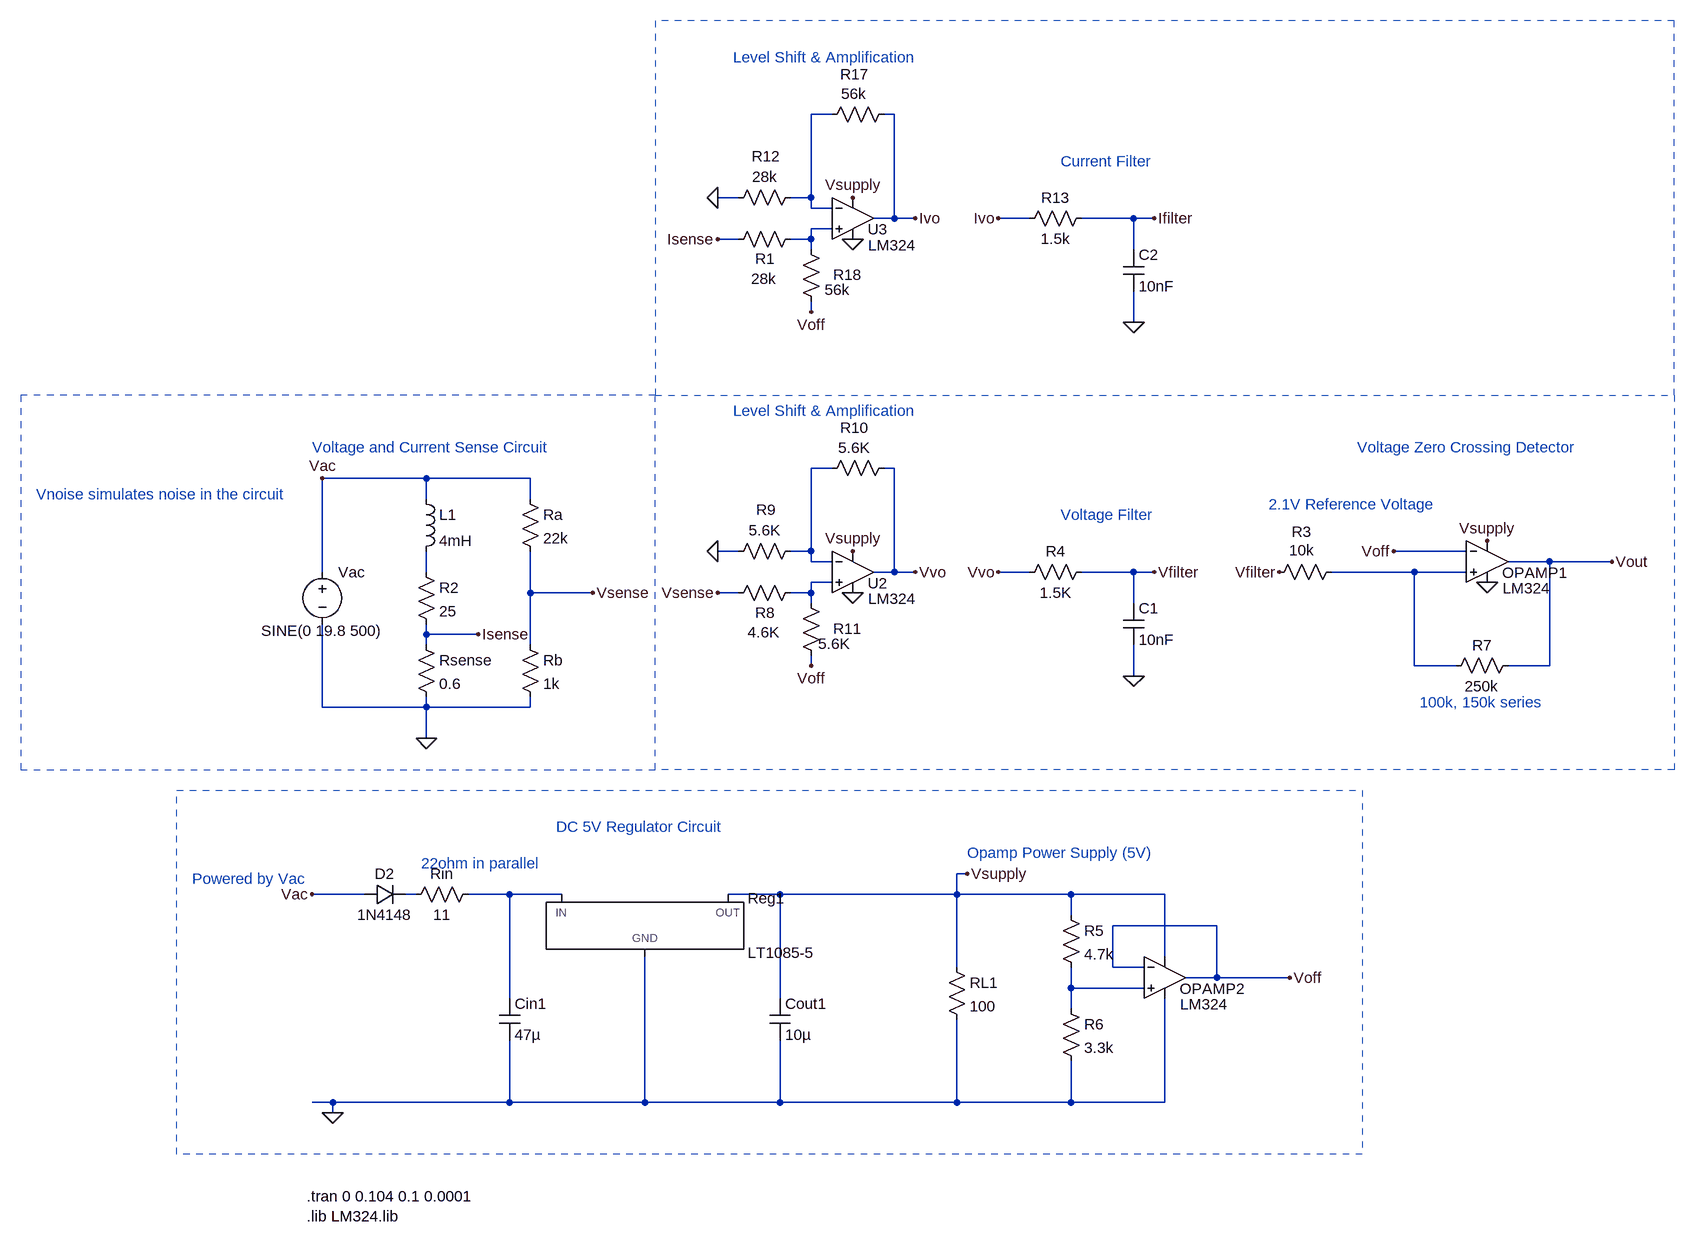
[diagram p0: schematic LTSpice implementation(With current sensor) - Copy.asc]
LTSpice implementation(With current sensor) - Copy.asc, the LTspice schematic file:
Version 4
SHEET 1 2040 1260
WIRE 64 -448 32 -448
WIRE 160 -448 144 -448
WIRE -80 -320 -112 -320
WIRE 32 -320 32 -448
WIRE 32 -320 0 -320
WIRE 32 -304 32 -320
WIRE 64 -304 32 -304
WIRE 160 -288 160 -448
WIRE 160 -288 128 -288
WIRE 192 -288 160 -288
WIRE 368 -288 320 -288
WIRE 528 -288 448 -288
WIRE 560 -288 528 -288
WIRE 64 -272 32 -272
WIRE -80 -256 -112 -256
WIRE 32 -256 32 -272
WIRE 32 -256 0 -256
WIRE 32 -240 32 -256
WIRE 528 -240 528 -288
WIRE 32 -144 32 -160
WIRE 528 -128 528 -176
WIRE 64 96 32 96
WIRE 160 96 144 96
WIRE -560 112 -720 112
WIRE -400 112 -560 112
WIRE -560 144 -560 112
WIRE -400 144 -400 112
WIRE -80 224 -112 224
WIRE 32 224 32 96
WIRE 32 224 0 224
WIRE 1040 224 928 224
WIRE 32 240 32 224
WIRE 64 240 32 240
WIRE 1168 240 1104 240
WIRE 1264 240 1168 240
WIRE -720 256 -720 112
WIRE -560 256 -560 224
WIRE 160 256 160 96
WIRE 160 256 128 256
WIRE 192 256 160 256
WIRE 368 256 320 256
WIRE 528 256 448 256
WIRE 560 256 528 256
WIRE 960 256 832 256
WIRE 1040 256 960 256
WIRE 64 272 32 272
WIRE -400 288 -400 224
WIRE -304 288 -400 288
WIRE -80 288 -112 288
WIRE 32 288 32 272
WIRE 32 288 0 288
WIRE 32 304 32 288
WIRE 528 304 528 256
WIRE -560 352 -560 336
WIRE -480 352 -560 352
WIRE -560 368 -560 352
WIRE -400 368 -400 288
WIRE 32 400 32 384
WIRE 960 400 960 256
WIRE 1024 400 960 400
WIRE 1168 400 1168 240
WIRE 1168 400 1104 400
WIRE 528 416 528 368
WIRE -720 464 -720 336
WIRE -560 464 -560 448
WIRE -560 464 -720 464
WIRE -400 464 -400 448
WIRE -400 464 -560 464
WIRE -560 512 -560 464
WIRE 272 720 256 720
WIRE -656 752 -736 752
WIRE -576 752 -592 752
WIRE -432 752 -496 752
WIRE -352 752 -432 752
WIRE -16 752 -96 752
WIRE 256 752 256 720
WIRE 256 752 -16 752
WIRE 432 752 256 752
WIRE 576 752 432 752
WIRE 432 784 432 752
WIRE 656 800 496 800
WIRE 576 848 576 752
WIRE 256 864 256 752
WIRE 496 864 496 800
WIRE 544 864 496 864
WIRE 656 880 656 800
WIRE 656 880 608 880
WIRE 768 880 656 880
WIRE 432 896 432 864
WIRE 544 896 432 896
WIRE -432 912 -432 752
WIRE -16 912 -16 752
WIRE 432 928 432 896
WIRE -704 1072 -736 1072
WIRE -432 1072 -432 976
WIRE -432 1072 -704 1072
WIRE -224 1072 -224 848
WIRE -224 1072 -432 1072
WIRE -16 1072 -16 976
WIRE -16 1072 -224 1072
WIRE 256 1072 256 944
WIRE 256 1072 -16 1072
WIRE 432 1072 432 1008
WIRE 432 1072 256 1072
WIRE 576 1072 576 912
WIRE 576 1072 432 1072
WIRE -704 1088 -704 1072
FLAG -560 512 0
FLAG 528 416 0
FLAG -720 112 Vac
FLAG -704 1088 0
FLAG -736 752 Vac
FLAG 272 720 Vsupply
FLAG 96 288 0
FLAG 96 224 Vsupply
FLAG -112 288 Vsense
FLAG -112 224 0
FLAG 192 256 Vvo
FLAG 32 400 Voff
FLAG 320 256 Vvo
FLAG -304 288 Vsense
FLAG 1072 272 0
FLAG 1264 240 Vout
FLAG 928 224 Voff
FLAG 1072 208 Vsupply
FLAG 752 256 Vfilter
FLAG 560 256 Vfilter
FLAG -480 352 Isense
FLAG 768 880 Voff
FLAG 96 -256 0
FLAG 96 -320 Vsupply
FLAG -112 -256 Isense
FLAG -112 -320 0
FLAG 192 -288 Ivo
FLAG 32 -144 Voff
FLAG 528 -128 0
FLAG 320 -288 Ivo
FLAG 560 -288 Ifilter
SYMBOL res -416 128 R0
SYMATTR InstName Ra
SYMATTR Value 22k
SYMBOL ind -576 128 R0
SYMATTR InstName L1
SYMATTR Value 4mH
SYMBOL res -576 240 R0
SYMATTR InstName R2
SYMATTR Value 25
SYMBOL res -576 352 R0
SYMATTR InstName Rsense
SYMATTR Value 0.6
SYMBOL voltage -720 240 R0
WINDOW 3 -94 106 Left 2
WINDOW 123 0 0 Left 0
WINDOW 39 0 0 Left 0
SYMATTR Value SINE(0 19.8 500)
SYMATTR InstName Vac
SYMBOL res -416 352 R0
SYMATTR InstName Rb
SYMATTR Value 1k
SYMBOL res 464 240 R90
WINDOW 0 0 56 VBottom 2
WINDOW 3 32 56 VTop 2
SYMATTR InstName R4
SYMATTR Value 1.5K
SYMBOL cap 512 304 R0
SYMATTR InstName C1
SYMATTR Value 10nF
SYMBOL PowerProducts/LT1085-5 -224 752 R0
SYMATTR InstName Reg1
SYMBOL res 240 848 R0
SYMATTR InstName RL1
SYMATTR Value 100
SYMBOL diode -656 768 R270
WINDOW 0 32 32 VTop 2
WINDOW 3 0 32 VBottom 2
SYMATTR InstName D2
SYMATTR Value 1N4148
SYMBOL cap -448 912 R0
SYMATTR InstName Cin1
SYMATTR Value 47µ
SYMATTR SpiceLine Rser=0.001
SYMBOL cap -32 912 R0
SYMATTR InstName Cout1
SYMATTR Value 10µ
SYMATTR SpiceLine Rser=0.001
SYMBOL res 416 768 R0
SYMATTR InstName R5
SYMATTR Value 4.7k
SYMBOL res 416 912 R0
SYMATTR InstName R6
SYMATTR Value 3.3k
SYMBOL Opamps/opamp2 96 192 R0
WINDOW 0 23 81 Left 2
WINDOW 3 24 105 Left 2
SYMATTR InstName U2
SYMATTR Value LM324
SYMBOL res 16 272 R90
WINDOW 0 62 55 VBottom 2
WINDOW 3 61 57 VTop 2
SYMATTR InstName R8
SYMATTR Value 4.6K
SYMBOL res 16 208 R90
WINDOW 0 -32 53 VBottom 2
WINDOW 3 -32 55 VTop 2
SYMATTR InstName R9
SYMATTR Value 5.6K
SYMBOL res 160 80 R90
WINDOW 0 -30 61 VBottom 2
WINDOW 3 -31 62 VTop 2
SYMATTR InstName R10
SYMATTR Value 5.6K
SYMBOL res 48 400 R180
WINDOW 0 -62 57 Left 2
WINDOW 3 -44 34 Left 2
SYMATTR InstName R11
SYMATTR Value 5.6K
SYMBOL Opamps/opamp2 1072 176 R0
WINDOW 0 23 81 Left 2
WINDOW 3 24 105 Left 2
SYMATTR InstName OPAMP1
SYMATTR Value LM324
SYMBOL res 848 240 R90
WINDOW 0 -30 61 VBottom 2
WINDOW 3 -2 61 VBottom 2
SYMATTR InstName R3
SYMATTR Value 10k
SYMBOL Opamps/opamp2 576 816 R0
WINDOW 0 23 81 Left 2
WINDOW 3 24 105 Left 2
SYMATTR InstName OPAMP2
SYMATTR Value LM324
SYMBOL res -480 736 R90
WINDOW 0 0 56 VBottom 2
WINDOW 3 32 56 VTop 2
SYMATTR InstName Rin
SYMATTR Value 11
SYMBOL res 1120 384 R90
WINDOW 0 0 56 VBottom 2
WINDOW 3 32 56 VTop 2
SYMATTR InstName R7
SYMATTR Value 250k
SYMBOL Opamps/opamp2 96 -352 R0
WINDOW 0 23 81 Left 2
WINDOW 3 24 105 Left 2
SYMATTR InstName U3
SYMATTR Value LM324
SYMBOL res 16 -272 R90
WINDOW 0 62 55 VBottom 2
WINDOW 3 61 57 VTop 2
SYMATTR InstName R1
SYMATTR Value 28k
SYMBOL res 16 -336 R90
WINDOW 0 -32 53 VBottom 2
WINDOW 3 -32 55 VTop 2
SYMATTR InstName R12
SYMATTR Value 28k
SYMBOL res 160 -464 R90
WINDOW 0 -30 61 VBottom 2
WINDOW 3 -31 62 VTop 2
SYMATTR InstName R17
SYMATTR Value 56k
SYMBOL res 48 -144 R180
WINDOW 0 -62 57 Left 2
WINDOW 3 -44 34 Left 2
SYMATTR InstName R18
SYMATTR Value 56k
SYMBOL res 464 -304 R90
WINDOW 0 0 56 VBottom 2
WINDOW 3 32 56 VTop 2
SYMATTR InstName R13
SYMATTR Value 1.5k
SYMBOL cap 512 -240 R0
SYMATTR InstName C2
SYMATTR Value 10nF
TEXT -736 64 Left 2 ;Voltage and Current Sense Circuit
TEXT -88 8 Left 2 ;Level Shift & Amplification
TEXT -360 648 Left 2 ;DC 5V Regulator Circuit
TEXT 272 688 Left 2 ;Opamp Power Supply (5V)
TEXT -920 728 Left 2 ;Powered by Vac
TEXT 416 168 Left 2 ;Voltage Filter
TEXT -744 1216 Left 2 !.tran 0 0.104 0.1 0.0001\n.lib LM324.lib
TEXT 872 64 Left 2 ;Voltage Zero Crossing Detector
TEXT 736 152 Left 2 ;2.1V Reference Voltage
TEXT -1160 136 Left 2 ;Vnoise simulates noise in the circuit
TEXT -568 704 Left 2 ;22ohm in parallel
TEXT 968 456 Left 2 ;100k, 150k series
TEXT -88 -536 Left 2 ;Level Shift & Amplification
TEXT 416 -376 Left 2 ;Current Filter
RECTANGLE Normal 880 1152 -944 592 2
RECTANGLE Normal -1184 560 -208 -16 2
RECTANGLE Normal 1360 560 -208 -16 2
RECTANGLE Normal 1360 -592 -208 -16 2

The netlist it stands for:
* LTSpice implementation(With current sensor) - Copy.asc
Ra Vac Vsense 22k
L1 Vac N004 4mH
R2 N004 Isense 25
Rsense Isense 0 0.6
Vac Vac 0 SINE(0 19.8 500)
Rb Vsense 0 1k
R4 Vfilter Vvo 1.5K
C1 Vfilter 0 10nF
XReg1 0 Vsupply N008 LT1085-5  ; pins GND OUT IN
RL1 Vsupply 0 100
D2 Vac N007 1N4148
Cin1 N008 0 47µ Rser=0.001
Cout1 Vsupply 0 10µ Rser=0.001
R5 Vsupply N009 4.7k
R6 N009 0 3.3k
XU2 N006 N003 Vsupply 0 Vvo LM324  ; pins In+ In- V+ V- OUT
R8 N006 Vsense 4.6K
R9 N003 0 5.6K
R10 Vvo N003 5.6K
R11 Voff N006 5.6K
XOPAMP1 N005 Voff Vsupply 0 Vout LM324  ; pins In+ In- V+ V- OUT
R3 N005 Vfilter 10k
XOPAMP2 N009 Voff Vsupply 0 Voff LM324  ; pins In+ In- V+ V- OUT
Rin N008 N007 11
R7 Vout N005 250k
XU3 N002 N001 Vsupply 0 Ivo LM324  ; pins In+ In- V+ V- OUT
R1 N002 Isense 28k
R12 N001 0 28k
R17 Ivo N001 56k
R18 Voff N002 56k
R13 Ifilter Ivo 1.5k
C2 Ifilter 0 10nF
.model D D
.lib standard.dio
* Voltage and Current Sense Circuit
* Level Shift & Amplification
* DC 5V Regulator Circuit
* Opamp Power Supply (5V)
* Powered by Vac
* Voltage Filter
.tran 0 0.104 0.1 0.0001
.lib LM324.lib
* Voltage Zero Crossing Detector
* 2.1V Reference Voltage
* Vnoise simulates noise in the circuit
* 22ohm in parallel
* 100k, 150k series
* Level Shift & Amplification
* Current Filter
.backanno
.end